# Altium project dtu.PrjPcb
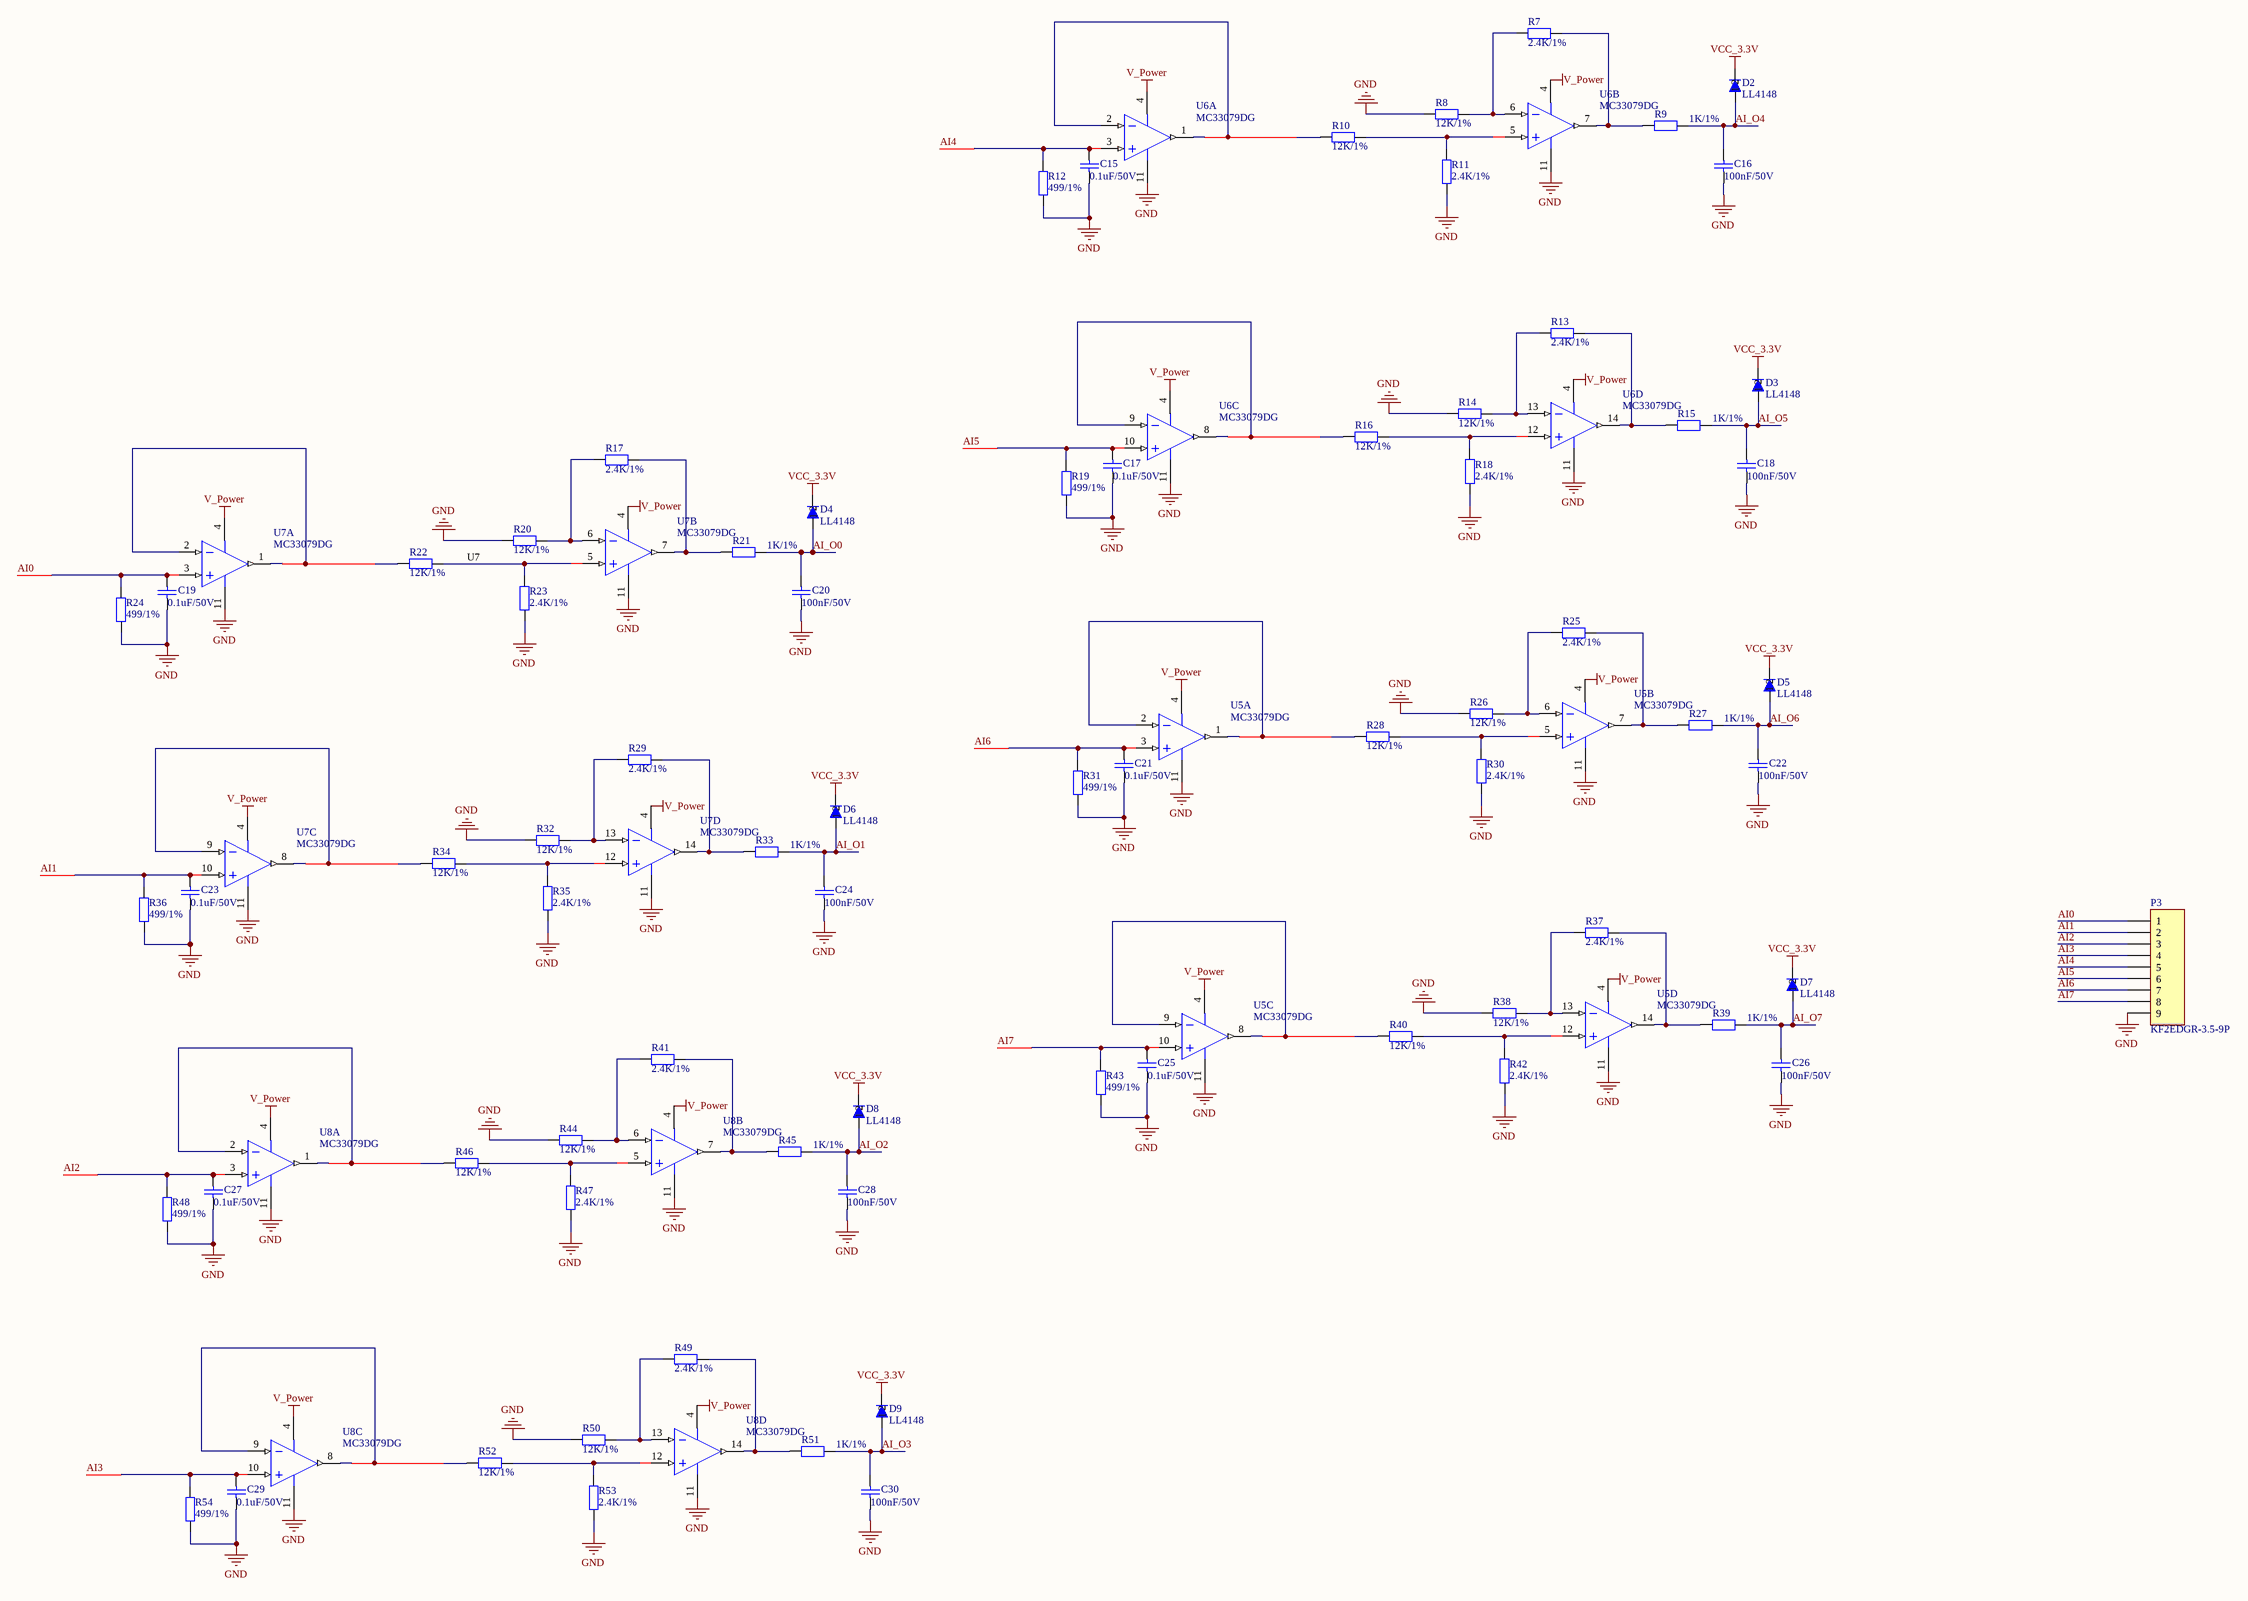
[diagram p0: ai.SchDoc]
3 sheets, 145 parts. Net scope: global (net labels, ports and power ports of the same name join across sheets).
Board file: DTU_V1.0.PcbDoc
Sheets:
  ai.SchDoc
  relay.SchDoc
  rs485.SchDoc

## Sheet ai.SchDoc
size A2; SheetNumber: 2; SheetTotal: 7

### Parts
C15  0.1uF/50V  [0603C]
C16  100nF/50V  [0603C]
C17  0.1uF/50V  [0603C]
C18  100nF/50V  [0603C]
C19  0.1uF/50V  [0603C]
C20  100nF/50V  [0603C]
C21  0.1uF/50V  [0603C]
C22  100nF/50V  [0603C]
C23  0.1uF/50V  [0603C]
C24  100nF/50V  [0603C]
C25  0.1uF/50V  [0603C]
C26  100nF/50V  [0603C]
C27  0.1uF/50V  [0603C]
C28  100nF/50V  [0603C]
C29  0.1uF/50V  [0603C]
C30  100nF/50V  [0603C]
D2  LL4148  [DO-213AB/LL34/MiniMELF]
D3  LL4148  [DO-213AB/LL34/MiniMELF]
D4  LL4148  [DO-213AB/LL34/MiniMELF]
D5  LL4148  [DO-213AB/LL34/MiniMELF]
D6  LL4148  [DO-213AB/LL34/MiniMELF]
D7  LL4148  [DO-213AB/LL34/MiniMELF]
D8  LL4148  [DO-213AB/LL34/MiniMELF]
D9  LL4148  [DO-213AB/LL34/MiniMELF]
P3  KF2EDGR-3.5-9P  [CONN-TH_9P-P3.50_KF2EDGR-3.5-9P]
R7  2.4K/1%  [0603R]
R8  12K/1%  [0603R]
R9  1K/1%  [0603R]
R10  12K/1%  [0603R]
R11  2.4K/1%  [0603R]
R12  499/1%  [0603R]
R13  2.4K/1%  [0603R]
R14  12K/1%  [0603R]
R15  1K/1%  [0603R]
R16  12K/1%  [0603R]
R17  2.4K/1%  [0603R]
R18  2.4K/1%  [0603R]
R19  499/1%  [0603R]
R20  12K/1%  [0603R]
R21  1K/1%  [0603R]
R22  12K/1%  [0603R]
R23  2.4K/1%  [0603R]
R24  499/1%  [0603R]
R25  2.4K/1%  [0603R]
R26  12K/1%  [0603R]
R27  1K/1%  [0603R]
R28  12K/1%  [0603R]
R29  2.4K/1%  [0603R]
R30  2.4K/1%  [0603R]
R31  499/1%  [0603R]
R32  12K/1%  [0603R]
R33  1K/1%  [0603R]
R34  12K/1%  [0603R]
R35  2.4K/1%  [0603R]
R36  499/1%  [0603R]
R37  2.4K/1%  [0603R]
R38  12K/1%  [0603R]
R39  1K/1%  [0603R]
R40  12K/1%  [0603R]
R41  2.4K/1%  [0603R]
R42  2.4K/1%  [0603R]
R43  499/1%  [0603R]
R44  12K/1%  [0603R]
R45  1K/1%  [0603R]
R46  12K/1%  [0603R]
R47  2.4K/1%  [0603R]
R48  499/1%  [0603R]
R49  2.4K/1%  [0603R]
R50  12K/1%  [0603R]
R51  1K/1%  [0603R]
R52  12K/1%  [0603R]
R53  2.4K/1%  [0603R]
R54  499/1%  [0603R]
U5  MC33079DG  [SOP-14_N]  (parts A,B,C,D of 4)
U6  MC33079DG  [SOP-14_N]  (parts A,B,C,D of 4)
U7  MC33079DG  [SOP-14_N]  (parts A,B,C,D of 4)
U8  MC33079DG  [SOP-14_N]  (parts A,B,C,D of 4)

### Nets
GND: C15.1 C16.1 C17.1 C18.1 C19.1 C20.1 C21.1 C22.1 C23.1 C24.1 C25.1 C26.1 C27.1 C28.1 C29.1 C30.1 P3.9 R8.1 R11.2 R12.2 R14.1 R18.2 R19.2 R20.1 R23.2 R24.2 R26.1 R30.2 R31.2 R32.1 R35.2 R36.2 R38.1 R42.2 R43.2 R44.1 R47.2 R48.2 R50.1 R53.2 R54.2 U5.11(GND) U6.11(GND) U7.11(GND) U8.11(GND)  [project net FGND]
V_Power: U5.4(V+) U6.4(V+) U7.4(V+) U8.4(V+)
VCC_3.3V: D2.2(1) D3.2(1) D4.2(1) D5.2(1) D6.2(1) D7.2(1) D8.2(1) D9.2(1)
AI0: C19.2 P3.1 R24.1 U7.3(IN+)
AI1: C23.2 P3.2 R36.1 U7.10(IN+)
AI2: C27.2 P3.3 R48.1 U8.3(IN+)
AI3: C29.2 P3.4 R54.1 U8.10(IN+)
AI4: C15.2 P3.5 R12.1 U6.3(IN+)
AI5: C17.2 P3.6 R19.1 U6.10(IN+)
AI6: C21.2 P3.7 R31.1 U5.3(IN+)
AI7: C25.2 P3.8 R43.1 U5.10(IN+)
AI_O0: C20.2 D4.1(2) R21.2
AI_O1: C24.2 D6.1(2) R33.2
AI_O2: C28.2 D8.1(2) R45.2
AI_O3: C30.2 D9.1(2) R51.2
AI_O4: C16.2 D2.1(2) R9.2
AI_O5: C18.2 D3.1(2) R15.2
AI_O6: C22.2 D5.1(2) R27.2
AI_O7: C26.2 D7.1(2) R39.2
NetR7_1: R7.1 R8.2 U6.6(IN-)
NetR7_2: R7.2 R9.1 U6.7(OUT)
NetR10_1: R10.1 U6.1(OUT) U6.2(IN-)
NetR10_2: R10.2 R11.1 U6.5(IN+)
NetR13_1: R13.1 R14.2 U6.13(IN-)
NetR13_2: R13.2 R15.1 U6.14(OUT)
NetR16_1: R16.1 U6.8(OUT) U6.9(IN-)
NetR16_2: R16.2 R18.1 U6.12(IN+)
NetR17_1: R17.1 R20.2 U7.6(IN-)
NetR17_2: R17.2 R21.1 U7.7(OUT)
NetR22_1: R22.1 U7.1(OUT) U7.2(IN-)
NetR22_2: R22.2 R23.1 U7.5(IN+)
NetR25_1: R25.1 R26.2 U5.6(IN-)
NetR25_2: R25.2 R27.1 U5.7(OUT)
NetR28_1: R28.1 U5.1(OUT) U5.2(IN-)
NetR28_2: R28.2 R30.1 U5.5(IN+)
NetR29_1: R29.1 R32.2 U7.13(IN-)
NetR29_2: R29.2 R33.1 U7.14(OUT)
NetR34_1: R34.1 U7.8(OUT) U7.9(IN-)
NetR34_2: R34.2 R35.1 U7.12(IN+)
NetR37_1: R37.1 R38.2 U5.13(IN-)
NetR37_2: R37.2 R39.1 U5.14(OUT)
NetR40_1: R40.1 U5.8(OUT) U5.9(IN-)
NetR40_2: R40.2 R42.1 U5.12(IN+)
NetR41_1: R41.1 R44.2 U8.6(IN-)
NetR41_2: R41.2 R45.1 U8.7(OUT)
NetR46_1: R46.1 U8.1(OUT) U8.2(IN-)
NetR46_2: R46.2 R47.1 U8.5(IN+)
NetR49_1: R49.1 R50.2 U8.13(IN-)
NetR49_2: R49.2 R51.1 U8.14(OUT)
NetR52_1: R52.1 U8.8(OUT) U8.9(IN-)
NetR52_2: R52.2 R53.1 U8.12(IN+)

### Notes on the sheet
- U7

### Library data of the parts
C15-C30 = Cap: Capacitor
D2-D9 = LL4148: VISHAY,LL4148,圆柱体MiniMELF100V/2A,ROHS; 版本: V1.00; 名称: 快速开关二极管; 物料编号: APLLY; 制造商: VISHAY
P3 = Header 9: Header, 9-Pin
R7-R54 = Res0805M
U5-U8 = MAX908EPD: Quad High-speed, Ultra Low-power, Single-Supply TTL comparator

## Sheet relay.SchDoc
size A3; SheetNumber: 3; SheetTotal: 7
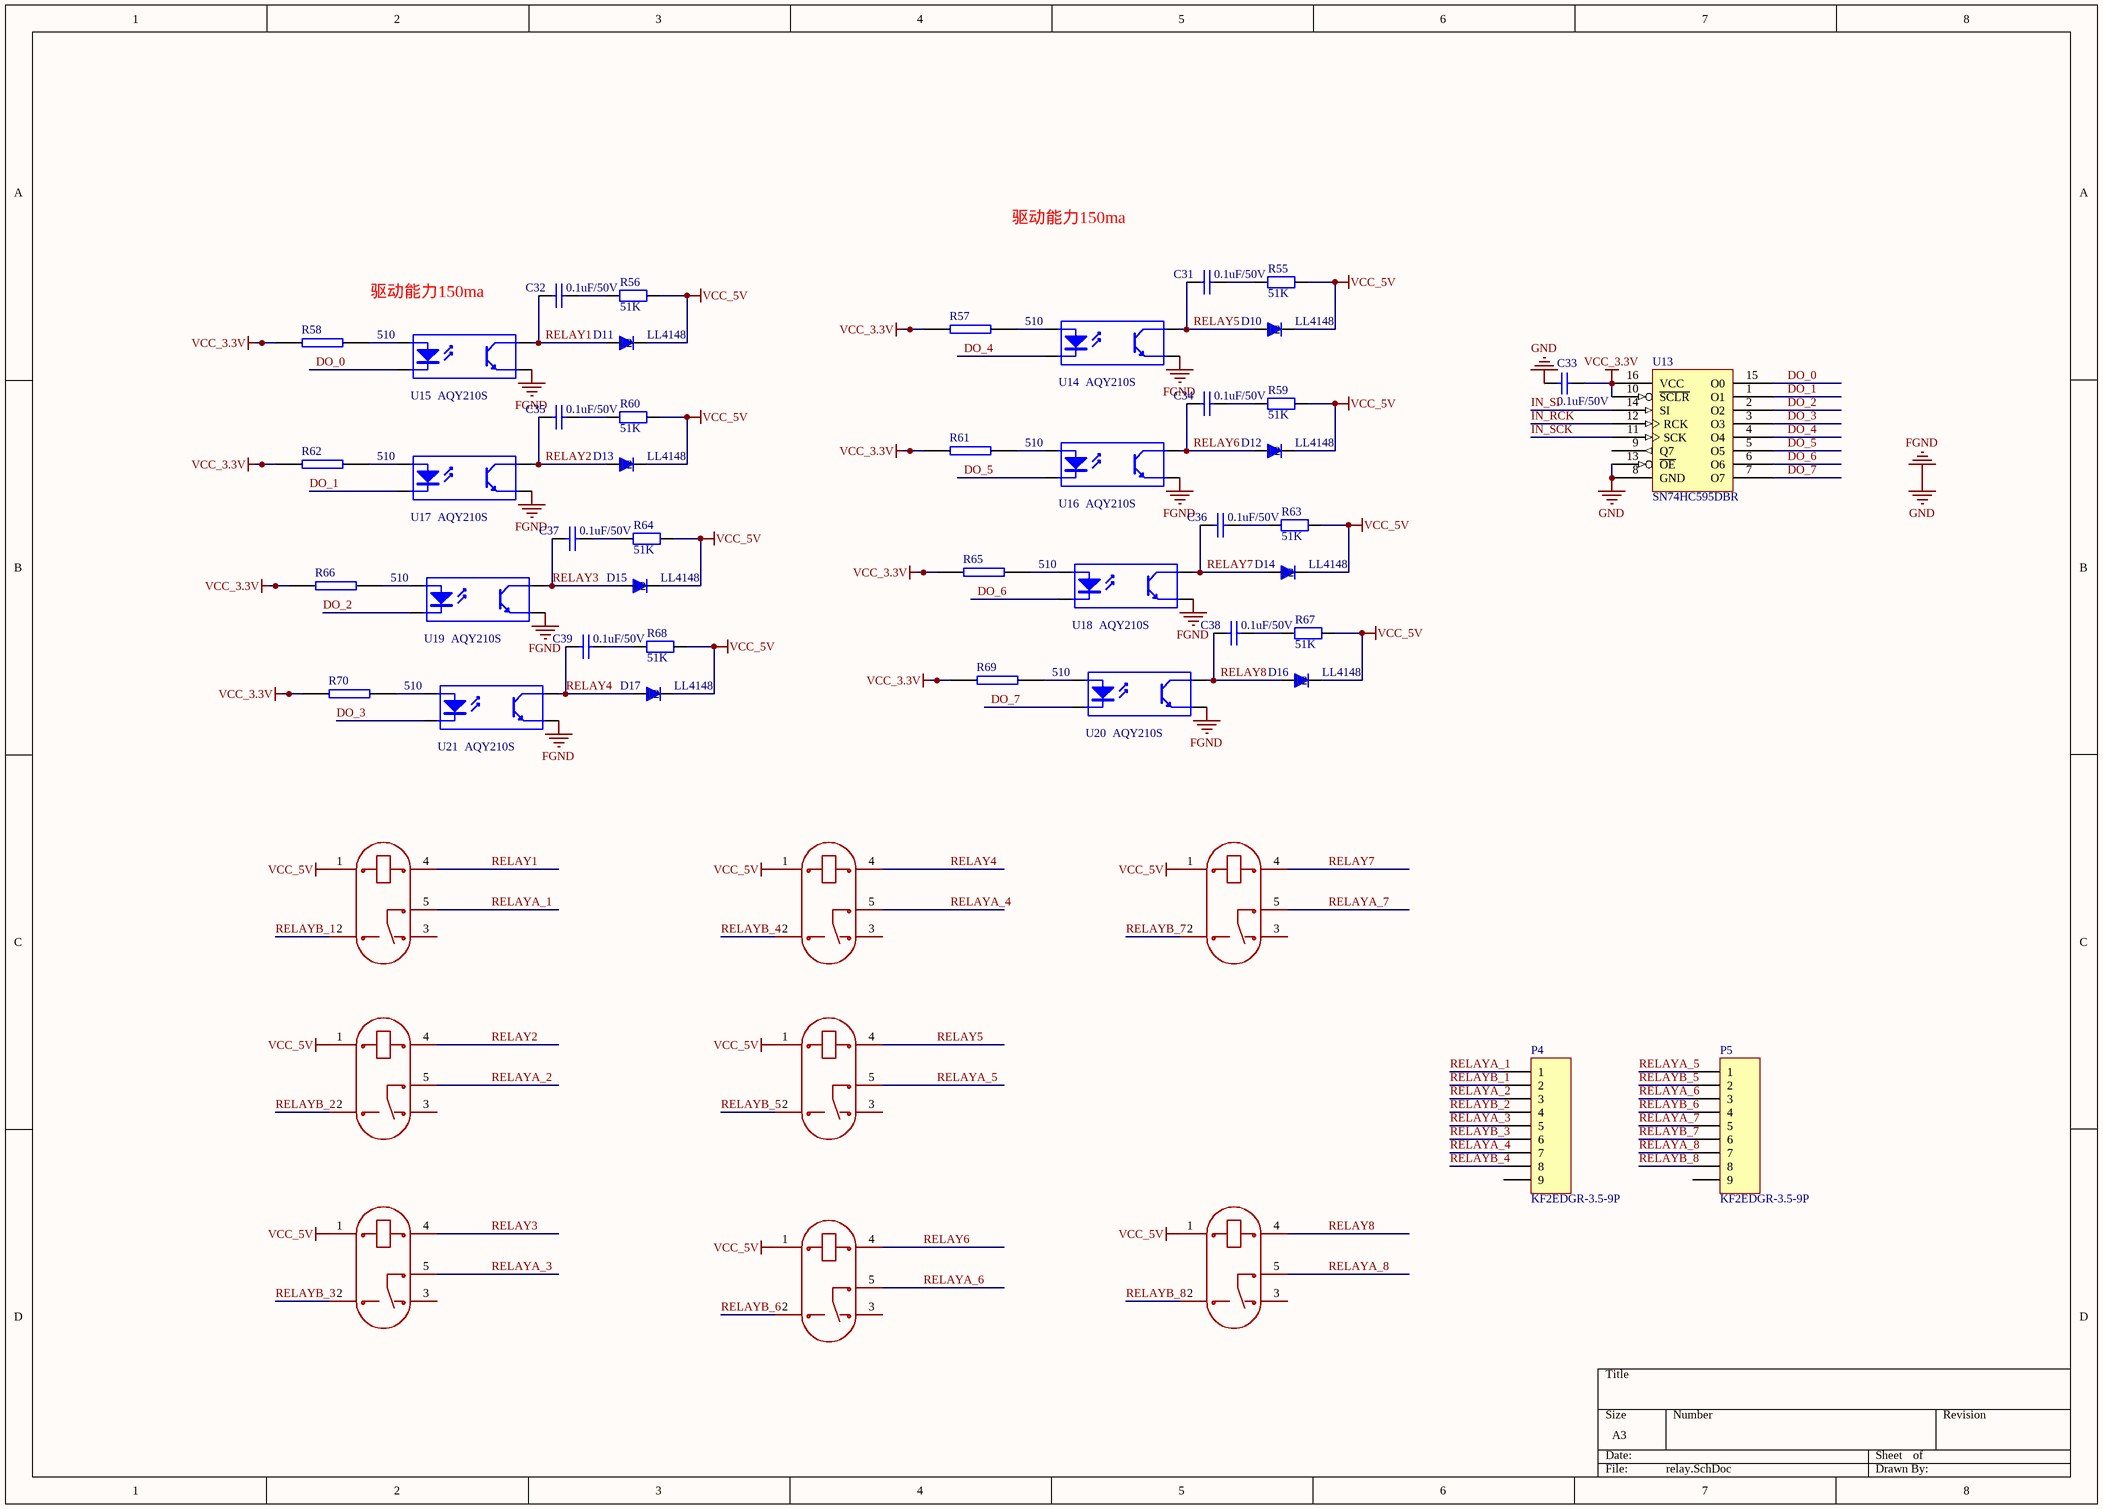
[diagram p1: relay.SchDoc]

### Parts
C31  0.1uF/50V  [0603C]
C32  0.1uF/50V  [0603C]
C33  0.1uF/50V  [0603C]
C34  0.1uF/50V  [0603C]
C35  0.1uF/50V  [0603C]
C36  0.1uF/50V  [0603C]
C37  0.1uF/50V  [0603C]
C38  0.1uF/50V  [0603C]
C39  0.1uF/50V  [0603C]
D10  LL4148  [DO-213AB/LL34/MiniMELF]
D11  LL4148  [DO-213AB/LL34/MiniMELF]
D12  LL4148  [DO-213AB/LL34/MiniMELF]
D13  LL4148  [DO-213AB/LL34/MiniMELF]
D14  LL4148  [DO-213AB/LL34/MiniMELF]
D15  LL4148  [DO-213AB/LL34/MiniMELF]
D16  LL4148  [DO-213AB/LL34/MiniMELF]
D17  LL4148  [DO-213AB/LL34/MiniMELF]
P4  KF2EDGR-3.5-9P  [CONN-TH_9P-P3.50_KF2EDGR-3.5-9P]
P5  KF2EDGR-3.5-9P  [CONN-TH_9P-P3.50_KF2EDGR-3.5-9P]
R55  51K  [0603R]
R56  51K  [0603R]
R57  510  [0603R]
R58  510  [0603R]
R59  51K  [0603R]
R60  51K  [0603R]
R61  510  [0603R]
R62  510  [0603R]
R63  51K  [0603R]
R64  51K  [0603R]
R65  510  [0603R]
R66  510  [0603R]
R67  51K  [0603R]
R68  51K  [0603R]
R69  510  [0603R]
R70  510  [0603R]
RLY1  SRD-05VDC-SL-C  [RELAY-TH_SRD-XXVDC-XL-C]  (value not drawn)
RLY2  SRD-05VDC-SL-C  [RELAY-TH_SRD-XXVDC-XL-C]  (value not drawn)
RLY3  SRD-05VDC-SL-C  [RELAY-TH_SRD-XXVDC-XL-C]  (value not drawn)
RLY4  SRD-05VDC-SL-C  [RELAY-TH_SRD-XXVDC-XL-C]  (value not drawn)
RLY5  SRD-05VDC-SL-C  [RELAY-TH_SRD-XXVDC-XL-C]  (value not drawn)
RLY6  SRD-05VDC-SL-C  [RELAY-TH_SRD-XXVDC-XL-C]  (value not drawn)
RLY7  SRD-05VDC-SL-C  [RELAY-TH_SRD-XXVDC-XL-C]  (value not drawn)
RLY8  SRD-05VDC-SL-C  [RELAY-TH_SRD-XXVDC-XL-C]  (value not drawn)
U13  SN74HC595DBR  [SSOP16]
U14  AQY210S  [sop4]
U15  AQY210S  [sop4]
U16  AQY210S  [sop4]
U17  AQY210S  [sop4]
U18  AQY210S  [sop4]
U19  AQY210S  [sop4]
U20  AQY210S  [sop4]
U21  AQY210S  [sop4]

### Nets
FGND: C33.2 U13.8(GND) U13.13(~{OE}) U14.3(E) U15.3(E) U16.3(E) U17.3(E) U18.3(E) U19.3(E) U20.3(E) U21.3(E)  [also labelled GND]
VCC_3.3V: C33.1 R57.2 R58.2 R61.2 R62.2 R65.2 R66.2 R69.2 R70.2 U13.10(~{SCLR}) U13.16(VCC)
VCC_5V: D10.2(1) D11.2(1) D12.2(1) D13.2(1) D14.2(1) D15.2(1) D16.2(1) D17.2(1) R55.2 R56.2 R59.2 R60.2 R63.2 R64.2 R67.2 R68.2 RLY1.1 RLY2.1 RLY3.1 RLY4.1 RLY5.1 RLY6.1 RLY7.1 RLY8.1
DO_0: U13.15(O0) U15.2(K)
DO_1: U13.1(O1) U17.2(K)
DO_2: U13.2(O2) U19.2(K)
DO_3: U13.3(O3) U21.2(K)
DO_4: U13.4(O4) U14.2(K)
DO_5: U13.5(O5) U16.2(K)
DO_6: U13.6(O6) U18.2(K)
DO_7: U13.7(O7) U20.2(K)
IN_RCK: U13.12(RCK)
IN_SCK: U13.11(SCK)
IN_SI: U13.14(SI)
RELAY1: C32.1 D11.1(2) RLY1.4 U15.4(C)
RELAY2: C35.1 D13.1(2) RLY4.4 U17.4(C)
RELAY3: C37.1 D15.1(2) RLY6.4 U19.4(C)
RELAY4: C39.1 D17.1(2) RLY2.4 U21.4(C)
RELAY5: C31.1 D10.1(2) RLY5.4 U14.4(C)
RELAY6: C34.1 D12.1(2) RLY8.4 U16.4(C)
RELAY7: C36.1 D14.1(2) RLY3.4 U18.4(C)
RELAY8: C38.1 D16.1(2) RLY7.4 U20.4(C)
RELAYA_1: P4.1 RLY1.5
RELAYA_2: P4.3 RLY4.5
RELAYA_3: P4.5 RLY6.5
RELAYA_4: P4.7 RLY2.5
RELAYA_5: P5.1 RLY5.5
RELAYA_6: P5.3 RLY8.5
RELAYA_7: P5.5 RLY3.5
RELAYA_8: P5.7 RLY7.5
RELAYB_1: P4.2 RLY1.2
RELAYB_2: P4.4 RLY4.2
RELAYB_3: P4.6 RLY6.2
RELAYB_4: P4.8 RLY2.2
RELAYB_5: P5.2 RLY5.2
RELAYB_6: P5.4 RLY8.2
RELAYB_7: P5.6 RLY3.2
RELAYB_8: P5.8 RLY7.2
NetC31_2: C31.2 R55.1
NetC32_2: C32.2 R56.1
NetC34_2: C34.2 R59.1
NetC35_2: C35.2 R60.1
NetC36_2: C36.2 R63.1
NetC37_2: C37.2 R64.1
NetC38_2: C38.2 R67.1
NetC39_2: C39.2 R68.1
NetR57_1: R57.1 U14.1(A)
NetR58_1: R58.1 U15.1(A)
NetR61_1: R61.1 U16.1(A)
NetR62_1: R62.1 U17.1(A)
NetR65_1: R65.1 U18.1(A)
NetR66_1: R66.1 U19.1(A)
NetR69_1: R69.1 U20.1(A)
NetR70_1: R70.1 U21.1(A)

Not connected (* = marked no-connect by the designer): P4 9; P5 9; RLY1 3; RLY2 3; RLY3 3; RLY4 3; RLY5 3; RLY6 3; RLY7 3; RLY8 3; U13 9(Q7)

### Notes on the sheet
- 驱动能力150ma

### Library data of the parts
C31 C32 C34-C39 = CAP: Capacitor
C33 = Cap: Capacitor; Value: 0.1uF
D10-D17 = LL4148: as D2 on sheet ai; 制造商: VISHAY
P4 P5 = Header 9: Header, 9-Pin
R55 R56 R59 R60 R63 R64 R67 R68 = Res0805M
R57 R58 R61 R62 R65 R66 R69 R70 = RES2
U13 = 74HC595
U14-U21 = Optoisolator1: 4-Pin Phototransistor Optocoupler

## Sheet rs485.SchDoc
size A4; SheetNumber: 7; SheetTotal: 7
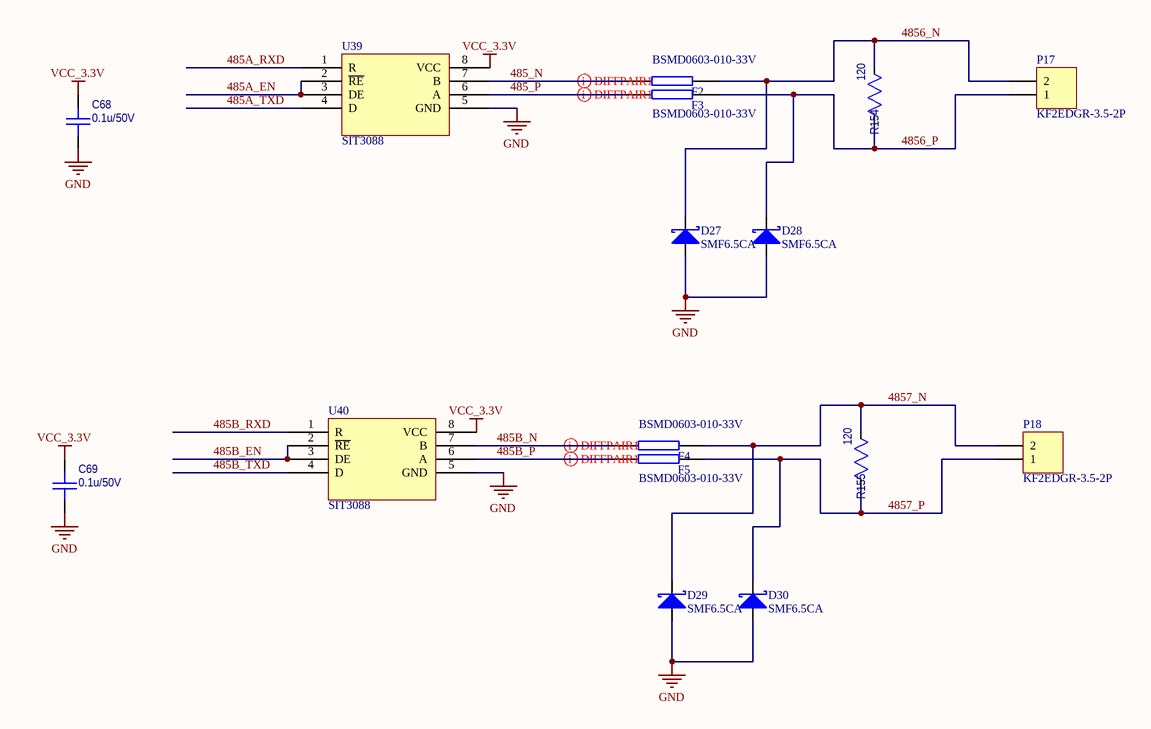
[diagram p2: rs485.SchDoc]

### Parts
C68  0.1u/50V  [CAPC1608X092N_0603]
C69  0.1u/50V  [CAPC1608X092N_0603]
D27  SMF6.5CA  [SOD123]
D28  SMF6.5CA  [SOD123]
D29  SMF6.5CA  [SOD123]
D30  SMF6.5CA  [SOD123]
F2  BSMD0603-010-33V  [0603R]
F3  BSMD0603-010-33V  [0603R]
F4  BSMD0603-010-33V  [0603R]
F5  BSMD0603-010-33V  [0603R]
P17  KF2EDGR-3.5-2P  [CONN-TH_P3.50_KF2EDGR-3.5-2P]
P18  KF2EDGR-3.5-2P  [CONN-TH_P3.50_KF2EDGR-3.5-2P]
R154  120  [RESC1608X055N_0603]  (no BOM)
R155  120  [RESC1608X055N_0603]  (no BOM)
U39  SIT3088  [so-8]
U40  SIT3088  [so-8]

### Nets
GND: C68.2 C69.2 D27.1(A) D28.1(A) D29.1(A) D30.1(A) U39.5(GND) U40.5(GND)  [project net FGND]
VCC_3.3V: C68.1 C69.1 U39.8(VCC) U40.8(VCC)
485_N: F2.2 U39.7(B)
485_P: F3.2 U39.6(A)
485A_EN: U39.2(~{RE}) U39.3(DE)
485A_RXD: U39.1(R)
485A_TXD: U39.4(D)
485B_EN: U40.2(~{RE}) U40.3(DE)
485B_N: F4.2 U40.7(B)
485B_P: F5.2 U40.6(A)
485B_RXD: U40.1(R)
485B_TXD: U40.4(D)
4856_N: D27.2(K) F2.1 P17.2 R154.1
4856_P: D28.2(K) F3.1 P17.1 R154.2
4857_N: D29.2(K) F4.1 P18.2 R155.1
4857_P: D30.2(K) F5.1 P18.1 R155.2

### Layout directives
differential pair: 485_N, 485_P, 485B_N, 485B_P

### Library data of the parts
C68 C69 = Capacitor_0603: Capacitor, MLCC; PartNumber: C0603C104M5RACTU; Voltage Rating: [voltage]; Package: 0603; Value: 0.1u/50V
D27-D30 = DIODE S: Value: SMBJ6.5A
F2-F5 = RES2
P17 P18 = Header 2: Header, 2-Pin
R154 R155 = Resistor_0603: Resistor, Standard; PartNumber: RC0603FR-1075KL; Package: 0603; Value: 120
U39 U40 = SN65HVD06D

## Nets that join several sheets
FGND: ai (45 pins), relay (11 pins), rs485 (8 pins)
VCC_3.3V: ai (8 pins), relay (11 pins), rs485 (C68.1 C69.1 U39.8 U40.8)